# EAGLE design plugV8-Relay-NO-Dummy_Board (EAGLE 7.5.0)
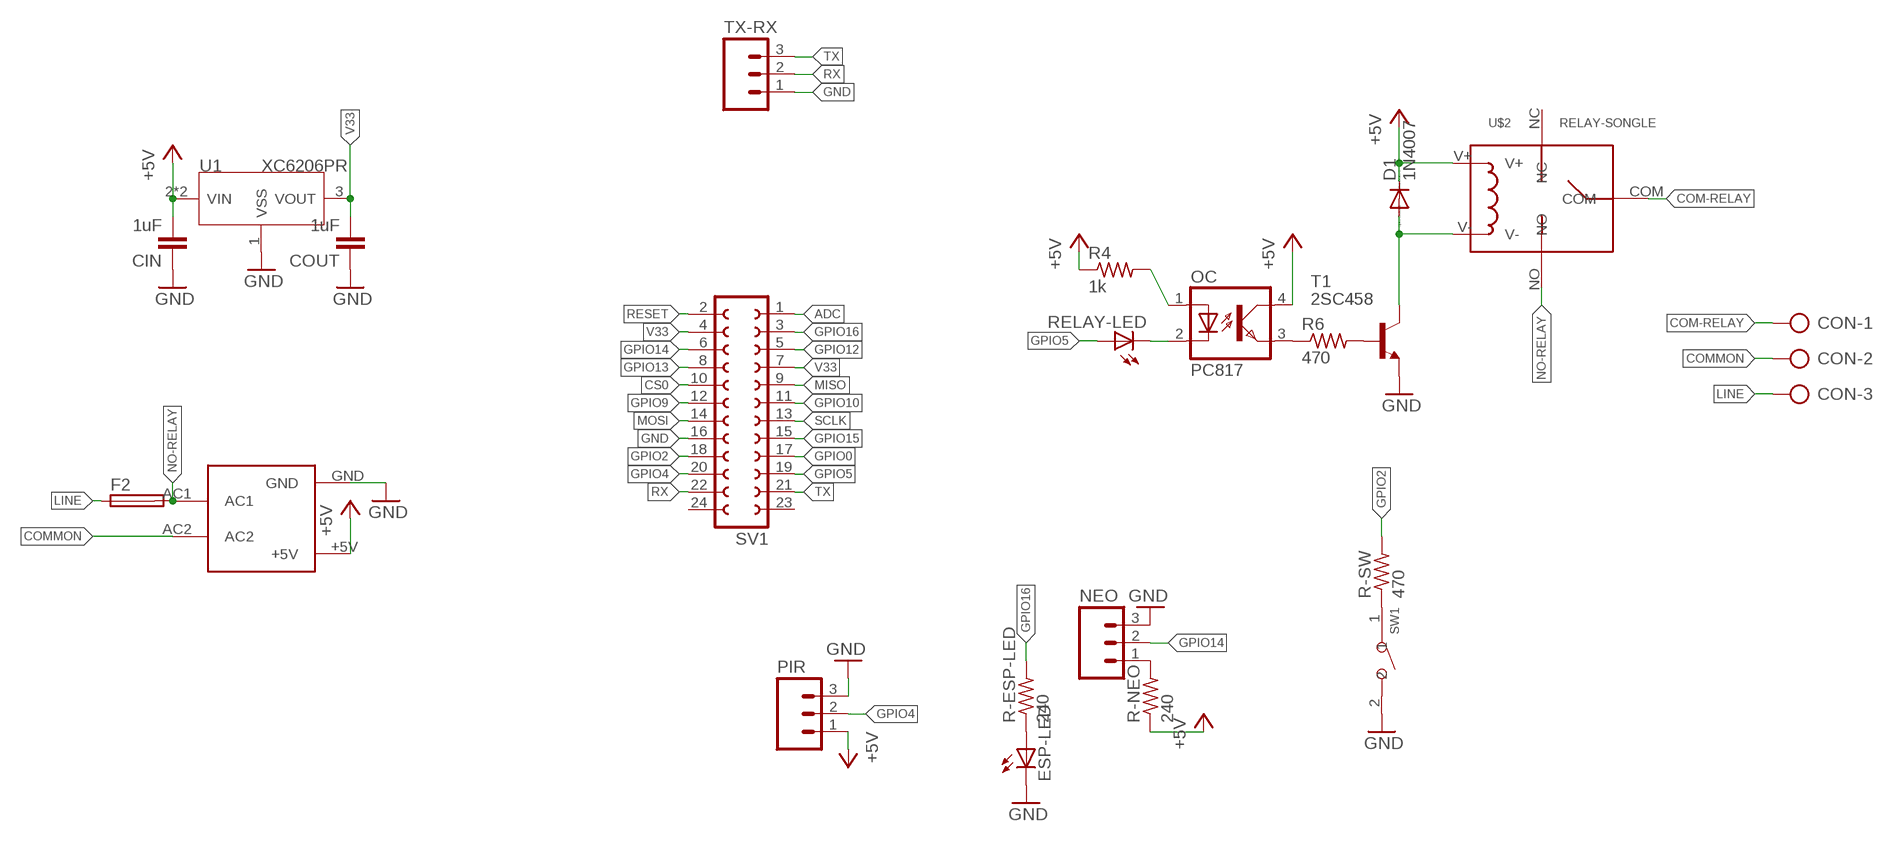
[diagram p0: schematic, sheet 1]

## Parts
CIN  1uF  C-EUC0805  [C0805]
CON  AK300/3  [AK300/3]
COUT  1uF  C-EUC0805  [C0805]
D1  1N4007  1N4004  [DO41-10]
ESP-LED  LED3MM  [LED3MM]
F2  TR5  [TR5]
NEO  M03PTH  [1X03]
OC  PC817  [DIL04]
PIR  M03PTH  [1X03]
R4  1k  R-US_0204/7  [0204/7]
R6  470  R-US_0204/7  [0204/7]
R-ESP-LED  240  R-US_0204/7  [0204/7]
R-NEO  240  R-US_0204/7  [0204/7]
R-SW  470  R-US_0204/7  [0204/7]
RELAY-LED  LED3MM  [LED3MM]
SV1  FE12-2  [FE12-2]
SW1  DIP-BUTTON(2P-6.0X3.0X4.3MM)-TS-1101F  [SW2-5.0-6.0X3.0X4.3MM]
T1  2SC458  [TO92-ECB]
TX-RX  M03PTH  [1X03]
U1  XC6206PR  [SOT89]
U$1  HLK-PM01  [HLK-PM01]
U$2  RELAY-SONGLE  [RELAY-SONGLE]

## Nets
+5V: CIN.2 D1.C OC.4(COL) PIR.1 R4.1 R-NEO.1 U1.2(VIN) U1.4(VIN) U$1.+5V U$2.V+
ADC: SV1.1
COM-RELAY: CON.1 U$2.COM
COMMON: CON.2 U$1.AC2
CS0: SV1.10
GND: CIN.1 COUT.1 ESP-LED.K(C) NEO.3 PIR.3 SV1.16 SW1.2 T1.E TX-RX.1 U1.1(VSS) U$1.GND
GPIO0: SV1.17
GPIO2: R-SW.2 SV1.18
GPIO4: PIR.2 SV1.20
GPIO5: RELAY-LED.A SV1.19
GPIO9: SV1.12
GPIO10: SV1.11
GPIO12: SV1.5
GPIO13: SV1.8
GPIO14: NEO.2 SV1.6
GPIO15: SV1.15
GPIO16: R-ESP-LED.2 SV1.3
LINE: CON.3 F2.1
MISO: SV1.9
MOSI: SV1.14
N$1: ESP-LED.A R-ESP-LED.1
N$2: OC.3(EMIT) R6.1
N$3: R6.2 T1.B
N$4: NEO.1 R-NEO.2
N$5: R-SW.1 SW1.1
N$6: OC.2(C) RELAY-LED.K(C)
N$13: OC.1(A) R4.2
N$18: D1.A T1.C U$2.V-
NO-RELAY: F2.2 U$1.AC1 U$2.NO
RESET: SV1.2
RX: SV1.22 TX-RX.2
SCLK: SV1.13
TX: SV1.21 TX-RX.3
V33: COUT.2 SV1.4 SV1.7 U1.3(VOUT)
Unconnected: SV1.23 SV1.24 U$2.NC

## Library data of the parts
CIN COUT = rcl:C-EU: CAPACITOR, European symbol
CON = con-ptr500:AK300/3: CONNECTOR; OC_FARNELL: unknown; OC_NEWARK: unknown
D1 = diode:1N4004: DIODE general purpose rectifier, 1 A
ESP-LED RELAY-LED = led:LED: LED OSRAM: - CHIPLED LG R971, LG N971, LY N971, LG Q971, LY Q971, LO R971, LY R971 LH N974, LH R974 LS Q976, LO Q976, LY Q976 LO Q996 - Hyper CHIPLED LW Q18S LB Q993, LB Q99A, LB R99A - SideLED LS A670, LO A670, LY A670, LG A670, LP A670 LB A673, LV A673, LT A673, LW A673 LH A674 LY A675 LS A676, LA A676, LO A676, LY A676, LW A676 LS A679, LY A679, LG A679 - Hyper Micro SIDELED® LS Y876, LA Y876, LO Y876, LY Y876 LT Y87S - SmartLED LW L88C, LW L88S LB L89C, LB L89S, LG L890 LS L89K, LO L89K, LY L89K LS L896, LA L896, LO L896, LY L896 - TOPLED LS T670, LO T670, LY T670, LG T670, LP T670 LSG T670, LSP T670, LSY T670, LOP T670, LYG T670 LG T671, LOG T671, LSG T671 LB T673, LV T673, LT T673, LW T673 LH T674 LS T676, LA T676, LO T676, LY T676, LB T676, LH T676, LSB T676, LW T676 LB T67C, LV T67C, LT T67C, LS T67K, LO T67K, LY T67K, LW E67C LS E67B, LA E67B, LO E67B, LY E67B, LB E67C, LV E67C, LT E67C LW T67C LS T679, LY T679, LG T679 LS T770, LO T770, LY T770, LG T770, LP T770 LB T773, LV T773, LT T773, LW T773 LH T774 LS E675, LA E675, LY E675, LS T675 LS T776, LA T776, LO T776, LY T776, LB T776 LHGB T686 LT T68C, LB T68C - Hyper Mini TOPLED® LB M676 - Mini TOPLED Santana® LG M470 LS M47K, LO M47K, LY M47K Source: http://www.osram.convergy.de LUXEON: - LUMILED® LXK2-PW12-R00, LXK2-PW12-S00, LXK2-PW14-U00, LXK2-PW14-V00 LXK2-PM12-R00, LXK2-PM12-S00, LXK2-PM14-U00 LXK2-PE12-Q00, LXK2-PE12-R00, LXK2-PE12-S00, LXK2-PE14-T00, LXK2-PE14-U00 LXK2-PB12-K00, LXK2-PB12-L00, LXK2-PB12-M00, LXK2-PB14-N00, LXK2-PB14-P00, LXK2-PB14-Q00 LXK2-PR12-L00, LXK2-PR12-M00, LXK2-PR14-Q00, LXK2-PR14-R00 LXK2-PD12-Q00, LXK2-PD12-R00, LXK2-PD12-S00 LXK2-PH12-R00, LXK2-PH12-S00 LXK2-PL12-P00, LXK2-PL12-Q00, LXK2-PL12-R00 Source: www.luxeon.com KINGBRIGHT: KA-3528ASYC Source: www.kingbright.com
F2 = fuse:TR5: FUSE Wickmann; OC_FARNELL: unknown; OC_NEWARK: unknown
NEO PIR TX-RX = SparkFun-Connectors:M03: Header 3 Standard 3-pin 0.1" header. Use with straight break away headers (SKU : PRT-00116), right angle break away headers (PRT-00553), swiss pins (PRT-00743), machine pins (PRT-00117), and female headers (PRT-00115). Molex polarized connector foot print use with SKU : PRT-08232 with associated crimp pins and housings.
OC = optocoupler:PC817: SHARP OPTO COUPLER; MPN: PC817X4J000F; OC_FARNELL: 9707727; OC_NEWARK: 97K7059
R4 R6 R-ESP-LED R-NEO R-SW = rcl:R-US_: RESISTOR, American symbol
SV1 = con-lsta:FE12-2: FEMALE HEADER; OC_FARNELL: unknown; OC_NEWARK: unknown
SW1 = Seeed-OPL-Switch:DIP-BUTTON(2P-6.0X3.0X4.3MM): 311020025
T1 = transistor:2SC458: NPN Silicon Epitaxial Planar Transistor Source: SEMTECH ELECTRONICS LTD. ... 2SC458 1.pdf
U1 = IC:XC6206: LOW ESR Cap.Compatible Positive Voltage Regulators
U$1 = HLK-PM01:HLK-PM01
U$2 = Seeed-OPL-Relay:RELAY-SONGLE

## Board
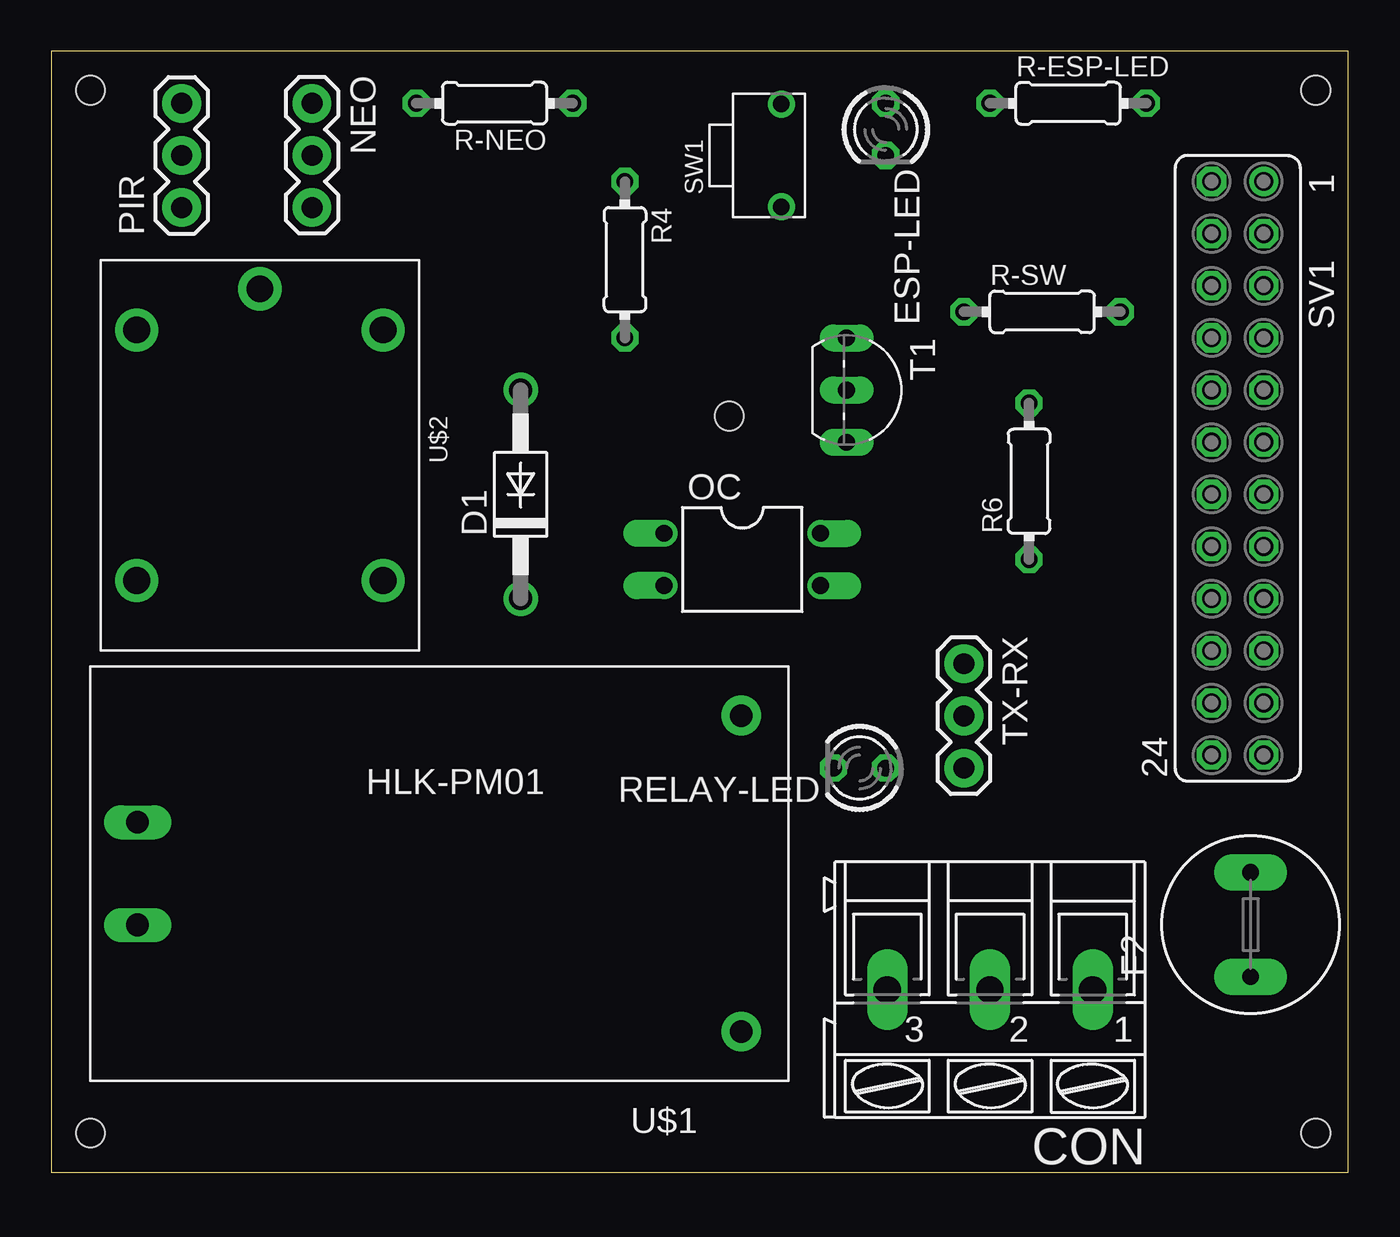
[diagram p1: board, top side]
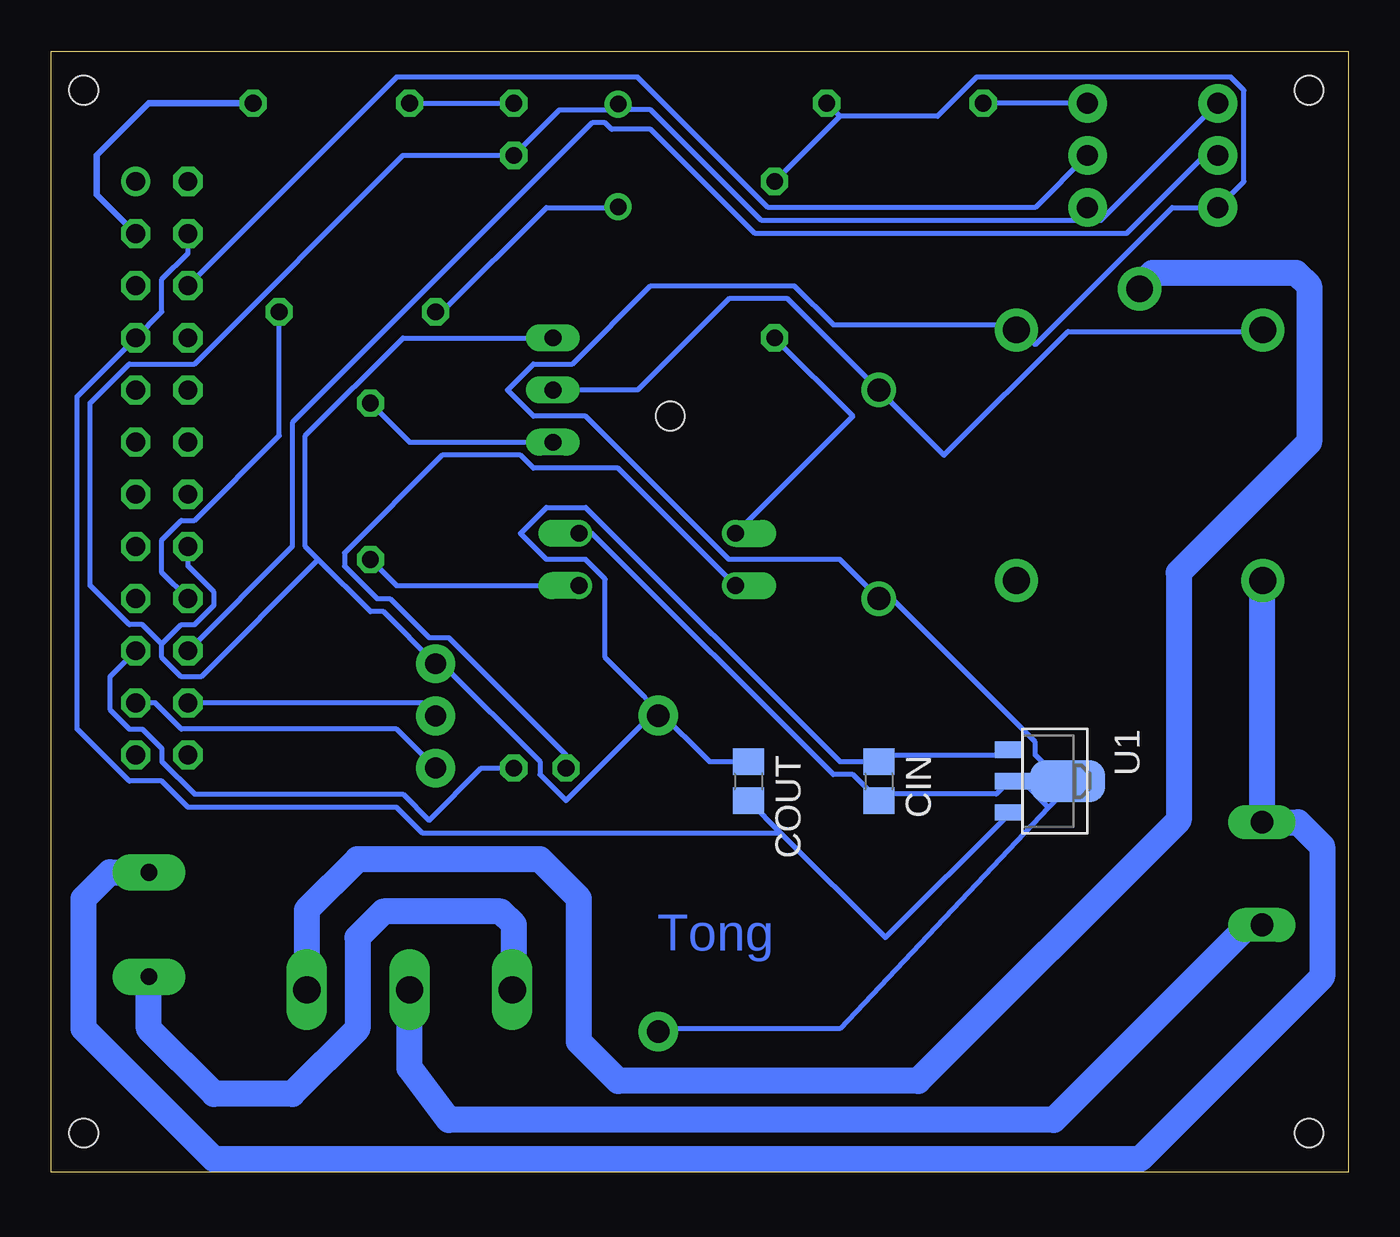
[diagram p2: board, bottom side, seen from below]

Size 63.17 x 54.6 mm. Coordinates in mm from the lower left corner, seen from the top.
Outline: 0,0 63.17,0 63.17,54.6 0,54.6 0,0
Copper layers (1*16): Top 0.035mm / dielectric 1.5mm / Bottom 0.035mm
Design rules "default": minimum track width 10mil, minimum drill 24mil, track to track 8mil, track to pad 8mil, pad to pad 8mil, via to via 8mil, smd to smd 8mil, copper to edge 40mil, drill to drill 8mil, minimum pad ring 10mil, minimum via ring 8mil, stop-mask expansion 4mil, vias tented up to drill 0mil, thermal gap 10mil
Holes 1.4 mm at 1.91,52.7 1.91,1.91 61.59,1.91 61.59,52.7 33.02,36.83

### Footprints (pad centres in the part's own frame; a part is rotated, then mirrored left to right if it is on the bottom)
C0805 = smd 1.3 x 1.5: 1 -0.95,0; 2 0.95,0
AK300/3 = drill 1.321 long: 1 -5.004,0; 2 0,0; 3 5.004,0
DO41-10 = drill 1.118: A 5.08,0; C -5.08,0
LED3MM = drill 0.813 octagon: A -1.27,0; K 1.27,0
TR5 = drill 0.813 pad 1.778 long: 1 -2.54,0; 2 2.54,0
1X03 = drill 1.016 pad 1.88: 1 0,0; 2 2.54,0; 3 5.08,0
DIL04 = drill 0.813 offset: 1 -1.27,-3.81; 2 1.27,-3.81; 3 1.27,3.81; 4 -1.27,3.81
0204/7 = drill 0.813 octagon: 1 -3.81,0; 2 3.81,0
FE12-2 = drill 0.914: 1 -13.97,1.27 | drill 0.914 octagon: 2 -13.97,-1.27; 3 -11.43,1.27; 4 -11.43,-1.27; 5 -8.89,1.27; 6 -8.89,-1.27; 7 -6.35,1.27; 8 -6.35,-1.27; 9 -3.81,1.27; 10 -3.81,-1.27; 11 -1.27,1.27; 12 -1.27,-1.27; 13 1.27,1.27; 14 1.27,-1.27; 15 3.81,1.27; 16 3.81,-1.27; 17 6.35,1.27; 18 6.35,-1.27; 19 8.89,1.27; 20 8.89,-1.27; 21 11.43,1.27; 22 11.43,-1.27; 23 13.97,1.27; 24 13.97,-1.27
SW2-5.0-6.0X3.0X4.3MM = drill 0.8 pad 1.27: 1 -2.5,0; 2 2.5,0
TO92-ECB = drill 0.813 long: B 2.54,0; C 0,0; E -2.54,0
SOT89 = smd 0.8 x 1.4: 1 -1.524,-1.905; 3 1.524,-1.905 | smd 0.8 x 1.9: 2 0,-1.651 | smd 2.032 x 3.65: 4 0,0.94
HLK-PM01 = drill 1.1 pad 1.93: +5V 15.19,-7.76; GND 15.19,7.64 | drill 1.1 long: AC1 -14.21,2.44; AC2 -14.21,-2.56
RELAY-SONGLE = drill 1.3 pad 2.1: COM -8.1,0; NC 6.1,6; NO 6.1,-6; V+ -6.1,6; V- -6.1,-6

### Placement (x,y rotation side)
CIN  22.86,19.05 270 bottom
CON  45.72,8.89 180 top
COUT  29.21,19.05 270 bottom
D1  22.86,33.02 90 top
ESP-LED  40.64,50.8 270 top
F2  58.42,12.06 90 top
NEO  12.7,52.07 270 top
OC  33.66,29.84 270 top
PIR  6.35,46.99 90 top
R4  27.94,44.45 270 top
R6  47.62,33.66 90 top
R-ESP-LED  49.53,52.07 0 top
R-NEO  21.59,52.07 180 top
R-SW  48.26,41.91 0 top
RELAY-LED  39.37,19.68 180 top
SV1  57.78,34.29 270 top
SW1  35.56,49.53 90 top
T1  38.73,38.1 270 top
TX-RX  44.45,24.77 270 top
U1  14.61,19.05 270 bottom
U$1  18.41,14.61 0 top
U$2  10.16,34.92 270 top

### Tracks (layer width: path | path; a pad name or v marks a point on that pad's centre or on a via)
+5V
  Bottom 0.254: 24.77,51.44 R4.1 | R-NEO.1 24.77,51.44 | 24.77,51.44 20,51.44 18.1,53.34 5.71,53.34 5.08,52.7 5.08,48.26 PIR.1 8.57,46.99 15.24,40.32 15.88,40.96 U$2.V+ 16.19,41.27 25.08,41.27 26.99,43.18 33.97,43.18 37.78,39.37 39.69,39.37 40.96,38.1 39.69,36.83 37.15,36.83 30.16,29.84 24.77,29.84 D1.C 22.23,27.94 15.24,20.95 15.24,20.32 13.97,19.05 | OC.4 36.83,31.11 25.08,19.37 24.13,19.37 CIN.2 22.86,18.41 17.14,18.41 16.51,19.05 U1.2 15.88,19.05 14.61,17.78 | 14.61,17.78 13.65,18.73 13.97,19.05 | 14.61,17.78 24.77,6.99 33.34,6.99 U$1.+5V | 13.97,19.05 U1.4
COM-RELAY
  Bottom 1.27: U$2.COM 10.16,43.18 9.53,43.81 2.54,43.81 1.91,43.18 1.91,35.56 8.26,29.21 8.26,17.14 20.95,4.45 35.56,4.45 37.47,6.35 37.47,13.34 39.37,15.24 48.26,15.24 50.72,12.78 CON.1
COMMON
  Bottom 1.27: CON.2 45.72,5.08 43.81,2.54 14.35,2.54 4.84,12.04 U$1.AC2
GND
  Bottom 0.254: 35.56,51.75 38.42,51.75 ESP-LED.K 46.04,49.53 56.2,39.37 59.37,39.37 61.28,37.47 61.28,28.57 59.37,26.67 58.74,26.67 57.78,25.72 | 12.06,46.35 PIR.3 | 35.56,51.75 33.97,51.75 28.57,46.35 12.06,46.35 | 35.56,51.75 SW1.2 | 12.06,46.35 NEO.3 | CIN.1 22.54,20.32 16.51,20.32 U1.1 | 33.66,22.54 33.97,22.86 U$1.GND | 33.66,22.54 31.11,20 COUT.1 | CIN.1 24.77,20 37.15,32.38 39.05,32.38 40.32,31.11 39.05,29.84 37.15,29.84 36.2,28.89 36.2,25.08 34.29,23.18 U$1.GND | CIN.1 | T1.E 46.04,40.64 50.8,35.88 50.8,30.48 50.16,29.84 | 50.16,29.84 47.62,27.3 46.99,27.3 TX-RX.1 44.13,24.77 39.37,20 39.37,19.37 38.1,18.1 33.66,22.54 | SV1.16 56.52,29.53 55.24,28.26 55.24,27.62 56.2,26.67 56.83,26.67 57.78,25.72 | 57.78,25.72 57.78,25.08 56.83,24.13 55.88,24.13 50.16,29.84 | 33.66,22.54 U$1.GND
GPIO2
  Bottom 0.254: R-SW.2 52.07,35.88 56.2,31.75 56.83,31.75 57.78,30.8 57.78,29.21 SV1.18
GPIO4
  Bottom 0.254: SV1.20 51.44,30.48 51.44,36.51 36.83,51.12 36.2,51.12 35.88,50.8 33.97,50.8 28.89,45.72 10.79,45.72 6.67,49.85 PIR.2
GPIO5
  Bottom 0.254: RELAY-LED.A 42.23,19.68 44.77,17.14 46.04,18.41 56.2,18.41 57.78,20 57.78,20.64 58.74,21.59 59.37,21.59 60.33,22.54 60.33,24.13 SV1.19
GPIO14
  Bottom 0.254: SV1.6 46.35,53.34 34.61,53.34 28.26,46.99 15.24,46.99 NEO.2
GPIO16
  Bottom 0.305: SV1.3 60.96,47.62 60.96,49.53 58.42,52.07 R-ESP-LED.2
LINE
  Bottom 1.27: CON.3 40.64,8.97 40.64,12.06 41.27,12.7 46.99,12.7 48.26,11.43 48.26,6.99 51.44,3.81 55.24,3.81 58.42,6.99 F2.1
N$1
  Bottom 0.254: R-ESP-LED.1 ESP-LED.A
N$2
  Bottom 0.254: OC.3 46.35,28.57 R6.1
N$3
  Bottom 0.254: T1.B 45.72,35.56 R6.2
N$4
  Bottom 0.254: NEO.1 R-NEO.2
N$5
  Bottom 0.254: R-SW.1 44.13,41.91 39.05,46.99 35.56,46.99 SW1.1
N$6
  Bottom 0.254: RELAY-LED.K 38.1,20.32 43.81,26.04 44.77,26.04 46.67,27.94 47.31,27.94 48.9,29.53 48.9,30.16 44.13,34.92 40.32,34.92 39.69,34.29 35.56,34.29 OC.2
N$13
  Bottom 0.254: OC.1 24.13,36.83 R4.2
N$18
  Bottom 0.254: T1.C 34.61,38.1 30.16,42.55 27.3,42.55 D1.A 19.68,34.92 13.65,40.96 4.45,40.96 U$2.V-
NO-RELAY
  Bottom 1.27: U$2.NO 4.21,28.82 U$1.AC1 2.44,17.05 1.27,15.88 1.27,9.53 10.16,0.64 55.24,0.64 61.59,6.99 61.59,13.34 60.33,14.61 F2.2
RX
  Bottom 0.254: SV1.22 45.09,22.86 TX-RX.2
TX
  Bottom 0.254: SV1.21 58.1,22.86 56.83,21.59 46.35,21.59 TX-RX.3
V33
  Bottom 0.254: SV1.4 56.52,44.77 57.78,43.5 57.78,41.91 SV1.7 61.91,37.78 61.91,21.59 59.37,19.05 57.78,19.05 56.52,17.78 46.35,17.78 45.09,16.51 27.62,16.51 | 27.62,16.51 COUT.2 | 27.62,16.51 22.54,11.43 16.51,17.46 U1.3

### Text on the board
Bottom: Tong